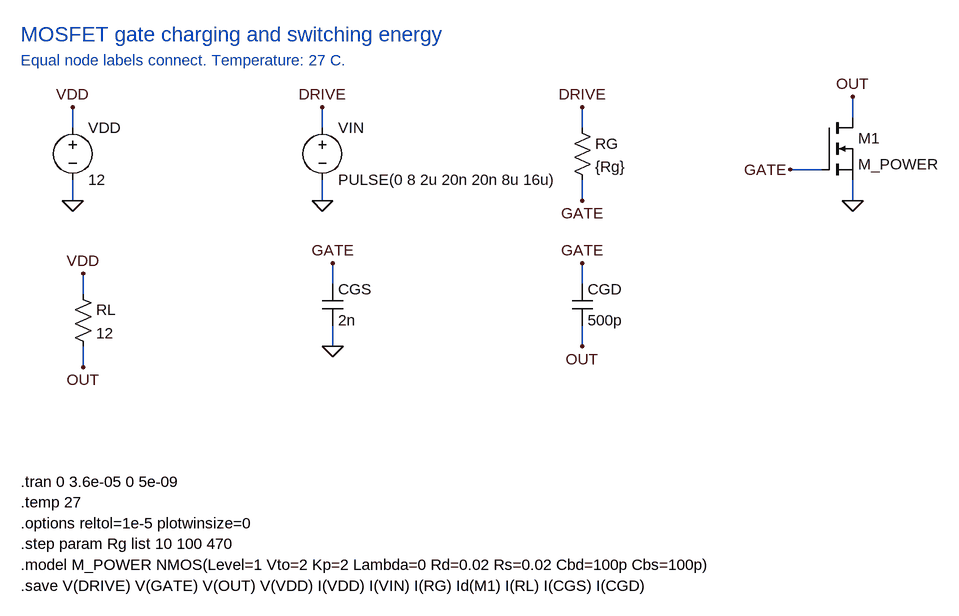
[diagram p0: schematic mosfet-gate-charging.asc]
mosfet-gate-charging.asc, the LTspice schematic file:
Version 4
SHEET 1 1740 1032
WIRE 144 176 144 144
WIRE 144 256 144 288
WIRE 528 176 528 144
WIRE 528 256 528 288
WIRE 928 176 928 144
WIRE 928 256 928 288
WIRE 1344 160 1344 128
WIRE 1296 240 1248 240
WIRE 1344 256 1344 288
WIRE 160 432 160 400
WIRE 160 512 160 544
WIRE 544 416 544 384
WIRE 544 480 544 512
WIRE 928 416 928 384
WIRE 928 480 928 512
FLAG 144 144 VDD
FLAG 144 288 0
FLAG 528 144 DRIVE
FLAG 528 288 0
FLAG 928 144 DRIVE
FLAG 928 288 GATE
FLAG 1344 128 OUT
FLAG 1248 240 GATE
FLAG 1344 288 0
FLAG 160 400 VDD
FLAG 160 544 OUT
FLAG 544 384 GATE
FLAG 544 512 0
FLAG 928 384 GATE
FLAG 928 512 OUT
SYMBOL voltage 144 160 R0
SYMATTR InstName VDD
SYMATTR Value 12
SYMBOL voltage 528 160 R0
SYMATTR InstName VIN
SYMATTR Value PULSE(0 8 2u 20n 20n 8u 16u)
SYMBOL res 912 160 R0
SYMATTR InstName RG
SYMATTR Value {Rg}
SYMBOL nmos 1296 160 R0
SYMATTR InstName M1
SYMATTR Value M_POWER
SYMBOL res 144 416 R0
SYMATTR InstName RL
SYMATTR Value 12
SYMBOL cap 528 416 R0
SYMATTR InstName CGS
SYMATTR Value 2n
SYMBOL cap 912 416 R0
SYMATTR InstName CGD
SYMATTR Value 500p
TEXT 64 32 Left 3 ;MOSFET gate charging and switching energy
TEXT 64 72 Left 2 ;Equal node labels connect. Temperature: 27 C.
TEXT 64 720 Left 2 !.tran 0 3.6e-05 0 5e-09
TEXT 64 752 Left 2 !.temp 27
TEXT 64 784 Left 2 !.options reltol=1e-5 plotwinsize=0
TEXT 64 816 Left 2 !.step param Rg list 10 100 470
TEXT 64 848 Left 2 !.model M_POWER NMOS(Level=1 Vto=2 Kp=2 Lambda=0 Rd=0.02 Rs=0.02 Cbd=100p Cbs=100p)
TEXT 64 880 Left 2 !.save V(DRIVE) V(GATE) V(OUT) V(VDD) I(VDD) I(VIN) I(RG) Id(M1) I(RL) I(CGS) I(CGD)

The netlist it stands for:
* mosfet-gate-charging.asc
VDD VDD 0 12
VIN DRIVE 0 PULSE(0 8 2u 20n 20n 8u 16u)
RG DRIVE GATE {Rg}
M1 OUT GATE 0 0 M_POWER
RL VDD OUT 12
CGS GATE 0 2n
CGD GATE OUT 500p
.model NMOS NMOS
.model PMOS PMOS
.lib standard.mos
* MOSFET gate charging and switching energy
* Equal node labels connect. Temperature: 27 C.
.tran 0 3.6e-05 0 5e-09
.temp 27
.options reltol=1e-5 plotwinsize=0
.step param Rg list 10 100 470
.model M_POWER NMOS(Level=1 Vto=2 Kp=2 Lambda=0 Rd=0.02 Rs=0.02 Cbd=100p Cbs=100p)
.save V(DRIVE) V(GATE) V(OUT) V(VDD) I(VDD) I(VIN) I(RG) Id(M1) I(RL) I(CGS) I(CGD)
.backanno
.end